# EAGLE design node2 (EAGLE 8.5.1)
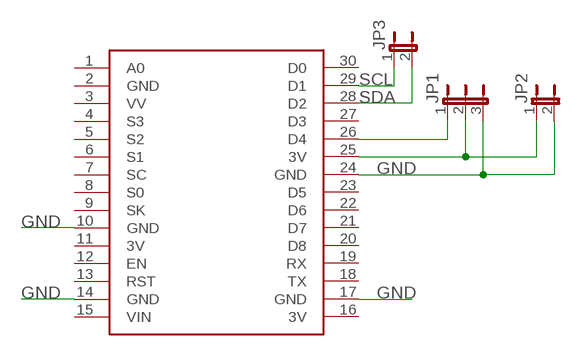
[diagram p0: schematic, sheet 1]

## Parts
JP1  JP2E  [JP2]
JP2  JP1E  [JP1]
JP3  JP1E  [JP1]
U$1  NODEMCU  [NODEMCU]

## Nets
GND: JP1.3 JP2.2 U$1.10(GND) U$1.14(GND) U$1.17(GND) U$1.24(GND)
N$1: JP1.1 U$1.26(D4)
N$2: JP1.2 JP2.1 U$1.25(3V)
SCL: JP3.1 U$1.29(D1)
SDA: JP3.2 U$1.28(D2)
Unconnected: U$1.1(A0) U$1.3(VV) U$1.4(S3) U$1.5(S2) U$1.6(S1) U$1.7(SC) U$1.8(S0) U$1.9(SK) U$1.12(EN) U$1.13(RST) U$1.15(VIN) U$1.18(TX) U$1.19(RX) U$1.20(D8) U$1.21(D7) U$1.22(D6) U$1.23(D5) U$1.27(D3) U$1.30(D0)

## Power pins joined to a net without a drawn wire
3V: U$1.11(3V) U$1.16(3V)
GND: U$1.2(GND)

## Library data of the parts
JP1 = jumper:JP2E: JUMPER
JP2 JP3 = jumper:JP1E: JUMPER
U$1 = nodemcu:NODEMCU

## Board
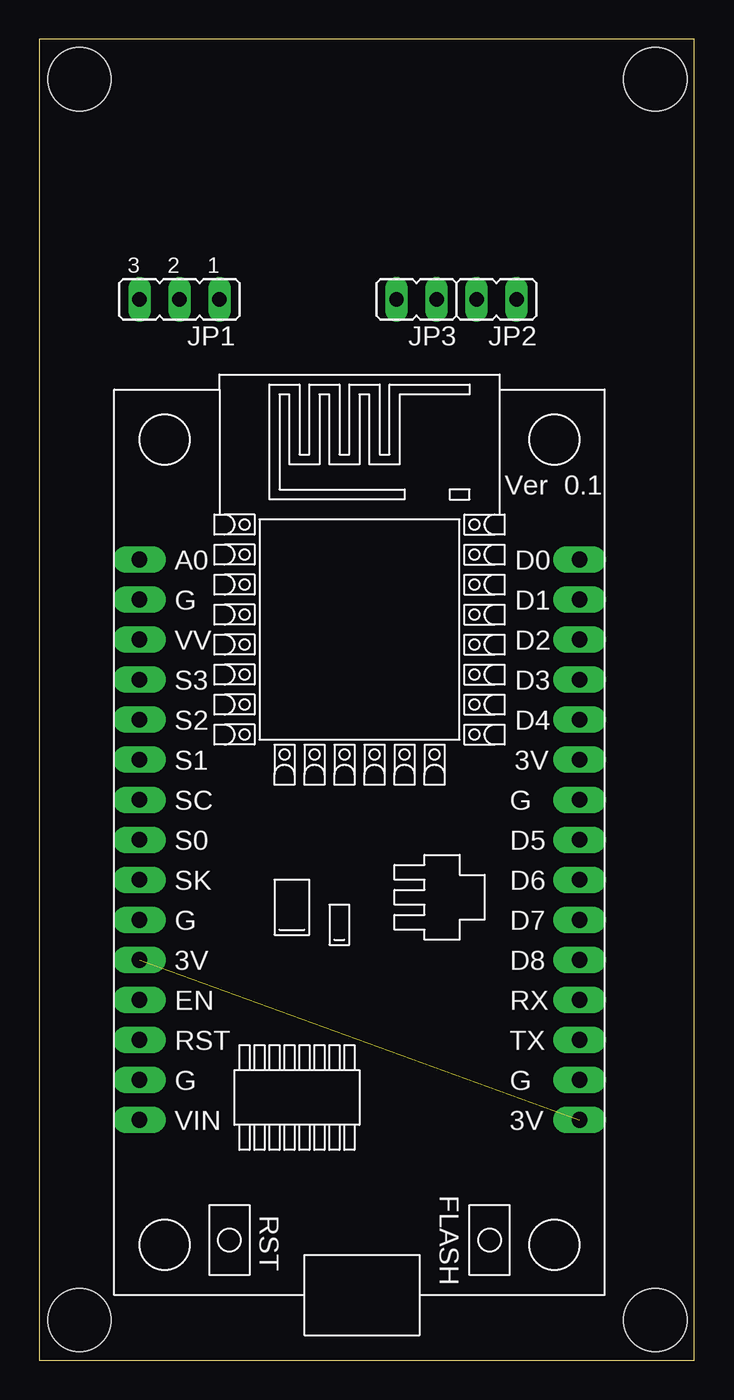
[diagram p1: board, top side]
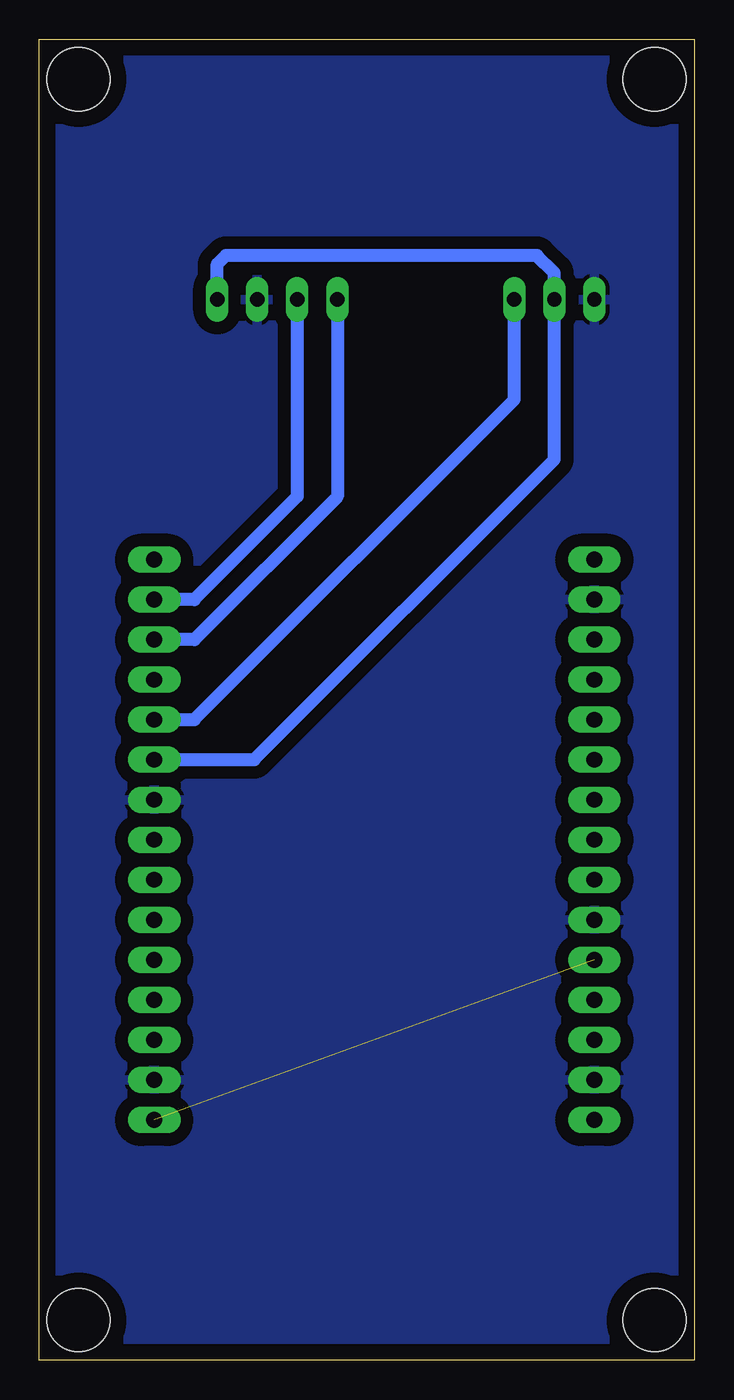
[diagram p2: board, bottom side, seen from below]

Size 41.58 x 83.81 mm. Coordinates in mm from the lower left corner, seen from the top.
Outline: 0,0 41.58,0 41.58,83.81 0,83.81 0,0
Copper layers (1*16): Top 0.035mm / dielectric 1.5mm / Bottom 0.035mm
Design rules "default": minimum track width 6mil, minimum drill 0.35mm, track to track 6mil, track to pad 6mil, pad to pad 6mil, via to via 6mil, smd to smd 6mil, copper to edge 40mil, drill to drill 6mil, minimum pad ring 10mil, minimum via ring 8mil, stop-mask expansion 4mil, vias tented up to drill 0mil, thermal gap 10mil
Holes 4 mm at 2.54,81.28 39.1,81.28 2.54,2.54 39.1,2.54

### Footprints (pad centres in the part's own frame; a part is rotated, then mirrored left to right if it is on the bottom)
JP2 = drill 0.914 long: 1 -2.54,0; 2 0,0; 3 2.54,0
JP1 = drill 0.914 long: 1 0,-1.27; 2 0,1.27
NODEMCU = drill 1 pad 1.676 long: 1 -13.97,17.78; 2 -13.97,15.24; 3 -13.97,12.7; 4 -13.97,10.16; 5 -13.97,7.62; 6 -13.97,5.08; 7 -13.97,2.54; 8 -13.97,0; 9 -13.97,-2.54; 10 -13.97,-5.08; 11 -13.97,-7.62; 12 -13.97,-10.16; 13 -13.97,-12.7; 14 -13.97,-15.24; 15 -13.97,-17.78; 16 13.97,-17.78; 17 13.97,-15.24; 18 13.97,-12.7; 19 13.97,-10.16; 20 13.97,-7.62; 21 13.97,-5.08; 22 13.97,-2.54; 23 13.97,0; 24 13.97,2.54; 25 13.97,5.08; 26 13.97,7.62; 27 13.97,10.16; 28 13.97,12.7; 29 13.97,15.24; 30 13.97,17.78

### Placement (x,y rotation side)
JP1  8.89,67.31 180 top
JP2  29.02,67.31 90 top
JP3  23.94,67.31 90 top
U$1  20.32,33.02 0 top

### Tracks (layer width: path | path; a pad name or v marks a point on that pad's centre or on a via)
3V  (1 unrouted)
GND
  pour Bottom (isolate 0.813): 0,0 40.64,0 40.64,83.82 0,83.82
N$1
  Bottom 0.813: JP1.1 11.43,64.77 11.43,63.23 11.43,60.96 31.75,40.64 U$1.26
N$2
  Bottom 0.813: U$1.25 27.94,38.1 8.89,57.15 JP1.2 8.89,69 9.99,70.09 29.75,70.09 30.29,69.56 JP2.1
SCL
  Bottom 0.813: U$1.29 31.75,48.26 25.21,54.8 JP3.1
SDA
  Bottom 0.813: U$1.28 31.75,45.72 22.67,54.8 JP3.2